# EasyEDA Pro project Power_Test.eprj

# Schematic Schematic1
Board Name: Board1; Create Date: 2025-09-05; Page Name: P1; Project Name: Power_Test; Schematic Name: Schematic1; Update Date: 2025-09-10; Company: EasyEDA.com; Page Size: A4; Version: V1.0
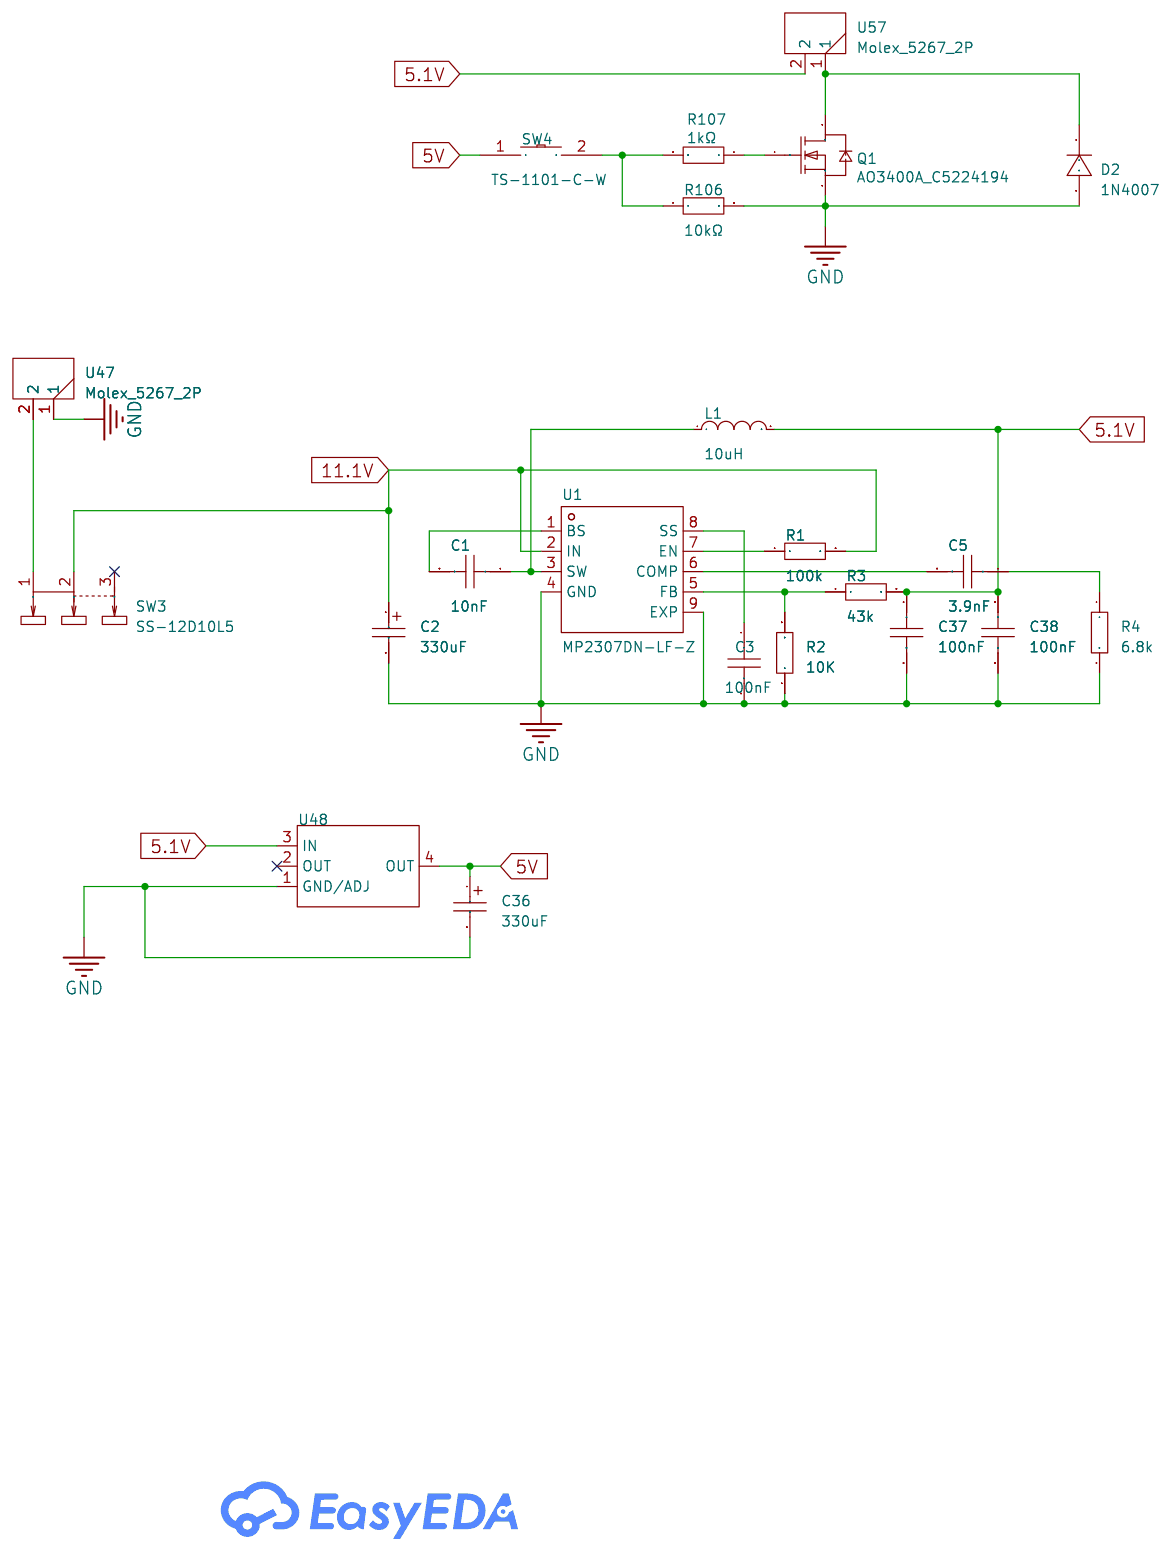
[diagram p0: schematic sheet]

## Parts
C1  10nF  [C0603]
C2  330uF  [CASE-D_7343]
C3  100nF  [C0603]
C5  3.9nF  [C0603]
C36  330uF  [CASE-D_7343]
C37  100nF  [C0603]
C38  100nF  [C0603]
D2  1N4007  [SMA_L4.4-W2.8-LS5.4-RD]
L1  10uH  [IND-SMD_L7.3-W6.6]
Q1  AO3400A_C5224194  [SOT-23-3_L3.0-W1.6-P1.90-LS2.8-BR]
R1  100k  [R0603]
R2  10K  [R0603]
R3  43k  [R0603]
R4  6.8k  [R0603]
R106  10kΩ  [R0603]
R107  1kΩ  [R0603]
SW3  SS-12D10L5  [SW-TH_SS-12D10L5]
SW4  TS-1101-C-W  [SW-SMD_L6.0-W3.3-LS8.0]
U1  MP2307DN-LF-Z  [SOP-8_L4.9-W3.9-P1.27-LS6.0-BL-EP]
U47  Molex_5267_2P  [5267_2P]
U48  AMS1117-5.0  [SOT-223-4_L6.5-W3.5-P2.30-LS7.0-BR]
U57  Molex_5267_2P  [5267_2P]

## Library data of the parts
C1 C3 C5 C37 C38 = CAP_0603: Supplier Footprint: 0603
C2 C36 = TAJD337K010RNJ: Capacitance: Tolerance:±10% Tolerance:±10% Rated Voltage: Equivalent Series Resistance(ESR):900mΩ@100kHz Operating Temperature:-55℃~+125℃ Operating Temperature:-55℃~+125℃; LCSC Part Name: 330uF ±10% 10V; Supplier Part: C7226; Manufacturer: Kyocera AVX; Supplier Footprint: CASE-D-7343; JLCPCB Part Class: Extended Part; Datasheet: https://atta.szlcsc.com/upload/public/pdf/source/20160107/1457707750344.pdf; Supplier: LCSC; Tolerance: ±10%; Equivalent Series Resistance(ESR): 900mΩ@100kHz; Operating Temperature: -55℃~+125℃
D2 = 1N4007_C126233: Diode Configuration:Independent Type Forward Voltage (Vf@If):1.1V@1A Reverse Voltage (Vr): Rectified Current: Reverse Leakage Current (Ir):5uA@1kV; LCSC Part Name: 停产; Supplier Part: C126233; Manufacturer: SHIKUES(时科); Supplier Footprint: SMA(DO-214AC); JLCPCB Part Class: Extended Part; Datasheet: https://atta.szlcsc.com/upload/public/pdf/source/20170818/C126233_1503051236073895256.pdf; Supplier: LCSC; Diode Configuration: Independent Type; Forward Voltage (Vf@If): 1.1V@1A; Reverse Leakage Current (Ir): 5uA@1kV
L1 = BMRB00060630100MA1: LCSC Part Name: 10uH ±20% 5.5A; Supplier Part: C5201679; Manufacturer: Chilisin(奇力新); Supplier Footprint: SMD,6.6x7.3mm; JLCPCB Part Class: Extended Part; Datasheet: https://item.szlcsc.com/datasheet/BMRB00060630100MA1/5890754.html; Supplier: LCSC; Tolerance: ±20%; Current Rating: 4A; Current - Saturation(Isat): 5.5A; DC Resistance(DCR): 68mΩ; Type: Magnetic Shielded Inductor
Q1 = AO3400A_C5224194: Supplier: LCSC; Supplier Part: C5224194; Manufacturer: ElecSuper(静芯微); Manufacturer Part: AO3400A; JLCPCB Part Class: Extended Part
R1-R4 = Res_0603: Supplier Footprint: 0603
R106 R107 = 1kΩ: Supplier: LCSC; Manufacturer: UNI-ROYAL(厚声); Manufacturer Part: 0603WAF1001T5E; Supplier Part: C21190; JLCPCB Part Class: Basic Part; link: https://lcsc.com/eda_search?q=C21190&%26type=1&ref=editor
SW3 = SS-12D10L5: Circuit:SPDT Actuator Style:Rectangular columnar Pin Style:PCPin Switch Length:13mm Switch Width:6.8mm Switch Height:6.4mm Mounting Style:Straight Actuator Color:Black Current Rating (DC):3A Voltage Rating (DC):125V Current Rating (AC):3A Voltage Rating (; LCSC Part Name: 柄长5mm 直插双档 滑动开关; Supplier Part: C319012; Manufacturer: XKB Connectivity(中国星坤); Supplier Footprint: 插件; JLCPCB Part Class: Extended Part; Datasheet: https://atta.szlcsc.com/upload/public/pdf/source/20211009/D6412F37AABE6F9459A6EE7FA4DAEADB.pdf; Supplier: LCSC; Circuit: SPDT; Actuator Style: Rectangular columnar; Pin Style: PCPin; Switch Length: 13mm; Switch Width: 6.8mm; Switch Height: 6.4mm; Mounting Style: Straight; Actuator Color: Black; Current Rating (DC): 3A; Voltage Rating (DC): 125V; Current Rating (AC): 3A; Voltage Rating (AC): 125V; Mechanical Life: 1万次; Operating Temperature: -40℃~+85℃
SW4 = TS-1101-C-W: LCSC Part Name: 6*3.6*2.5mm 立贴 轻触开关; Supplier Part: C318938; Manufacturer: XKB Connectivity(中国星坤); Supplier Footprint: SMD; JLCPCB Part Class: Extended Part; Datasheet: https://atta.szlcsc.com/upload/public/pdf/source/20200227/C318938_C2E53B1EEDE37D980A33616AC086DE53.pdf; Supplier: LCSC; Circuit: SPST; Actuator Style: Rectangle button; Operating Force: 260gf; Mounting Style: Brick nogging; Switch Length: 6mm; Switch Width: 3.6mm; Switch Height: 2.5mm; Strike Gundam: 不带; Contact Current: 50mA; Voltage Rating (DC): 12V; Actuator/Cap Color: 白色带淡绿; With Lamp: No; Mechanical Life: 5万次; Operating Temperature: -30℃~+85℃
U1 = MP2307DN-LF-Z: LCSC Part Name: 3A，23V，340KHz同步整流降压转换器; Supplier Part: C18921; Manufacturer: MPS(芯源); Supplier Footprint: SOIC-8N-EP-150mil; JLCPCB Part Class: Extended Part; Datasheet: https://item.szlcsc.com/datasheet/MP2307DN-LF-Z/19624.html; Supplier: LCSC; Function: Buck; Output Type: Adjustable; Voltage - Supply: 4.75V~23V; Output Voltage: 925mV~20V; Output Current: 3A; Operating Temperature: -40℃~+85℃; Synchronous Rectifier: Yes; Number of Outputs: 1; Topology: Buck; Switch tube (built-in/external): Built-in
U47 U57 = Molex_5267_2P
U48 = AMS1117-5.0_C489390: Output Type:Fixed Voltage - Supply:18V Output Voltage:5V Output Voltage:5V Output Current:800mA Power Supply Rejection Ratio (PSRR):- Voltage Dropout:1.3V@(800mA) Features:热关断(TSD) Output Configuration:Positive electrode Number of Outputs:1; LCSC Part Name: 输入18V 输出5V 800mA; Supplier Part: C489390; Manufacturer: KEXIN(科信); Supplier Footprint: SOT-223-4; JLCPCB Part Class: Extended Part; Datasheet: https://atta.szlcsc.com/upload/public/pdf/source/20200225/C489390_741098F4D0B289080ED6EC6326BDA35D.pdf; Supplier: LCSC; Output Type: Fixed; Voltage - Supply: 18V; Output Voltage: 5V; Output Current: 800mA; Voltage Dropout: 1.3V@(800mA); Features: 热关断(TSD); Output Configuration: Positive electrode; Number of Outputs: 1

## Nets
5.1V: C37.1 C38.1 L1.2 R3.2 U48.3(IN) U57.2
5V: C36.1 SW4.1 U48.4(OUT)
11.1V: C2.1 R1.2 SW3.2 U1.2(IN)
GND: C2.2 C3.2 C36.2 C37.2 C38.2 D2.2 Q1.2(S) R2.1 R4.2 R106.2 U1.4(GND) U1.9(EXP) U47.1 U48.1(GND/ADJ)
$1N529: C1.1 L1.1 U1.3(SW)
$1N557: C1.2 U1.1(BS)
$1N939: R1.1 U1.7(EN)
$1N946: R2.2 R3.1 U1.5(FB)
$1N1067: C3.1 U1.8(SS)
$1N1166: C5.2 U1.6(COMP)
$1N1221: C5.1 R4.1
$1N1682: SW3.1 U47.2
$1N1959: Q1.1(G) R107.1
$1N1960: R106.1 R107.2 SW4.2
$1N1961: D2.1 Q1.3(D) U57.1

Not connected (* = marked no-connect by the designer): SW3 3*; U48 2(OUT)*

# Board PCB1
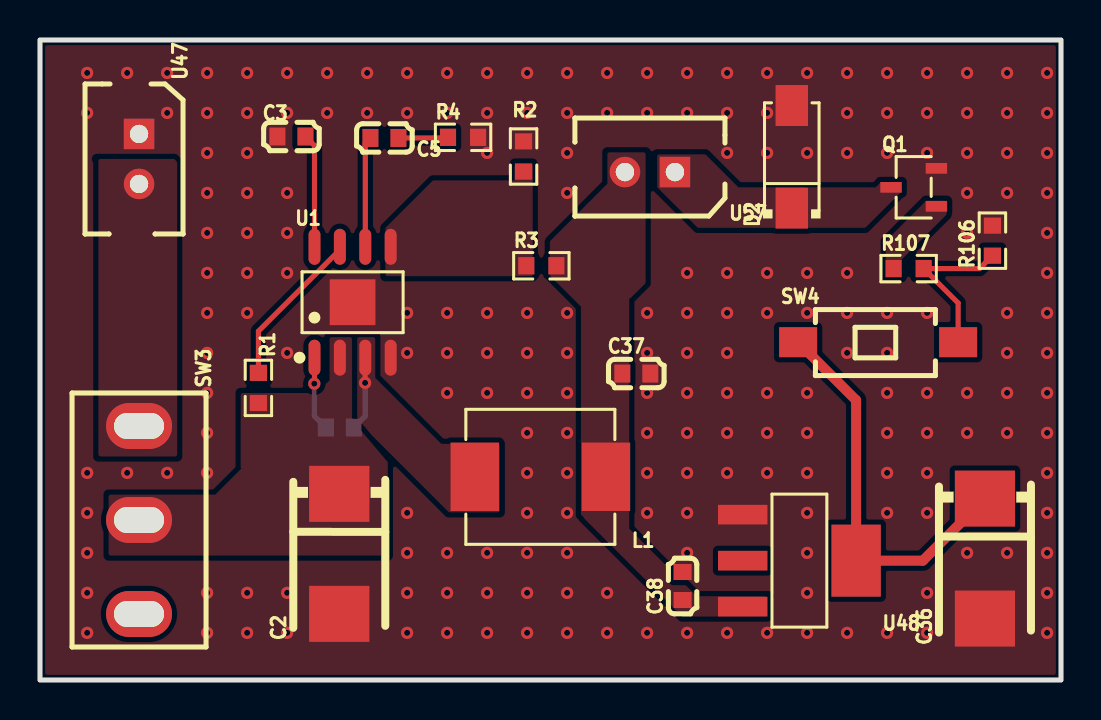
[diagram p1: board, top side]
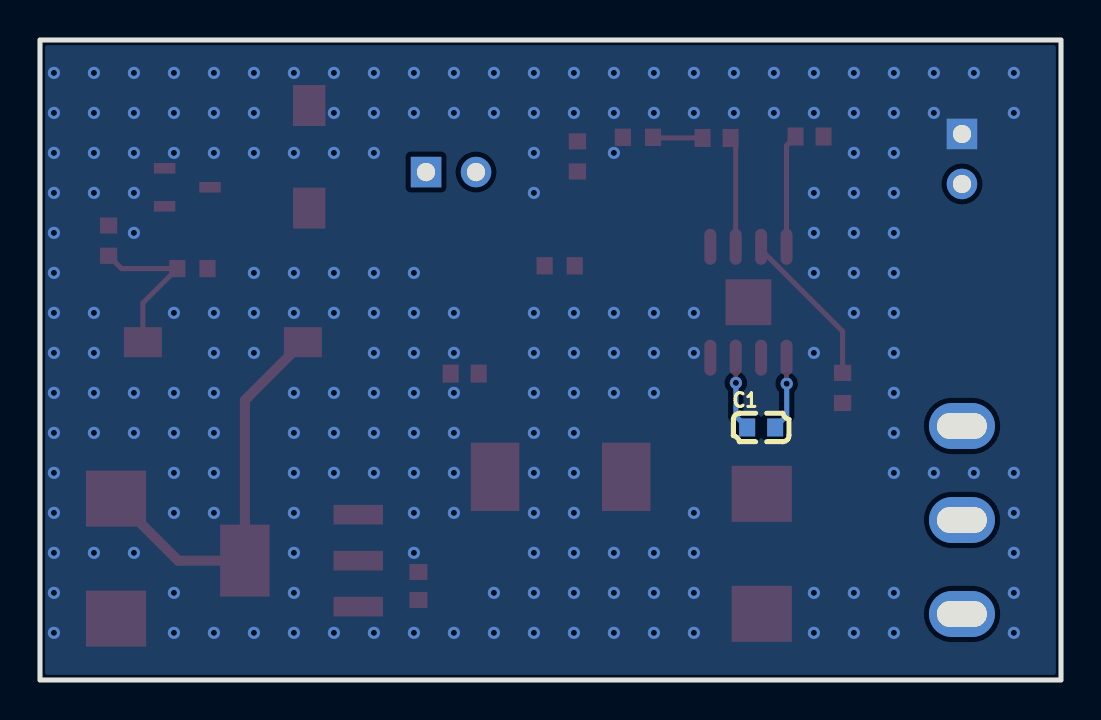
[diagram p2: board, bottom side, seen from below]

Outline 51.05 x 32 mm; copper layers: Top Layer, Bottom Layer. Coordinates in mm from the lower left corner of the outline.
Outline path: rectangle 0,32 51.05,0
Stack: Top Layer 0.035mm / Dielectric1 1.51mm FR4 er 4.5 / Bottom Layer 0.035mm

## Design rules (mm)
template: Custom Config
spacing copperThickness1oz (default): track to track 0.102, other pairs 0.152 to 0.3
spacing copperThickness2oz: track to track 0.203, other pairs 0.152 to 0.3
track width copperThickness1oz (default): min 0.127, default 0.254, max 2.54
track width copperThickness2oz: min 0.203, default 0.254, max 2.54
track width 5V: min 0.2, default 0.5, max 1
differential pair differentialPair (default): width min 0.127, default 0.254, max 2.54; gap min 0.152, default 0.152
via viaSize (default): diameter min 0.5, default 0.61, max 10; hole min 0.3, default 0.305, max 6.3
net 5V uses 5V
net 5.1V uses 5V

## Placement (name value [footprint] x y rotation side)
C1  10nF  [C0603]  14.99 12.63 180 bottom
C2  330uF  [CASE-D_7343]  14.97 6.31 90 top
C3  100nF  [C0603]  12.57 27.18 180 top
C5  3.9nF  [C0603]  17.22 27.11 180 top
C36  330uF  [CASE-D_7343]  47.25 6.07 90 top
C37  100nF  [C0603]  29.82 15.33 0 top
C38  100nF  [C0603]  32.13 4.7 90 top
D2  1N4007  [SMA_L4.4-W2.8-LS5.4-RD]  37.59 26.16 90 top
L1  10uH  [IND-SMD_L7.3-W6.6]  25.02 10.16 180 top
Q1  AO3400A_C5224194  [SOT-23-3_L3.0-W1.6-P1.90-LS2.8-BR]  43.69 24.64 0 top
R1  100k  [R0603]  10.92 14.61 270 top
R2  10K  [R0603]  24.18 26.18 270 top
R3  43k  [R0603]  25.07 20.71 0 top
R4  6.8k  [R0603]  21.15 27.14 0 top
R106  10kΩ  [R0603]  47.62 21.97 90 top
R107  1kΩ  [R0603]  43.43 20.57 0 top
SW3  SS-12D10L5  [SW-TH_SS-12D10L5]  4.95 8 270 top
SW4  TS-1101-C-W  [SW-SMD_L6.0-W3.3-LS8.0]  41.91 16.89 0 top
U1  MP2307DN-LF-Z  [SOP-8_L4.9-W3.9-P1.27-LS6.0-BL-EP]  15.63 18.89 0 top
U47  Molex_5267_2P  [5267_2P]  4.95 27.31 270 top
U48  AMS1117-5.0  [SOT-223-4_L6.5-W3.5-P2.30-LS7.0-BR]  37.97 5.97 180 top
U57  Molex_5267_2P  [5267_2P]  31.75 25.4 180 top

## Footprints (pads in the part's own frame, mm; a bottom-side part is the same pattern mirrored in y, then rotated)
5267_2P
  rect 1.524x1.524 hole 0.914: 1(0,0)
  round 1.524 hole 0.914: 2(2.5,0)
C0603
  rect 0.8x0.9 smd: 1(-0.7,0) 2(0.7,0)
CASE-D_7343
  rect 2.799x3.01 smd: 1(3,0) 2(-3,0)
IND-SMD_L7.3-W6.6
  rect 2.424x3.42 smd: 1(3.278,0) 2(-3.278,0)
R0603
  rect 0.806x0.864 smd: 1(-0.753,0) 2(0.753,0)
SMA_L4.4-W2.8-LS5.4-RD
  rect 2.046x1.62 smd: 1(-2.566,0) 2(2.566,0)
SOP-8_L4.9-W3.9-P1.27-LS6.0-BL-EP
  oval 0.6x1.8 smd: 1(-1.905,-2.772) 2(-0.635,-2.772) 3(0.635,-2.772) 4(1.905,-2.772) 5(1.905,2.772) 6(0.635,2.772) 7(-0.635,2.772) 8(-1.905,2.772)
  rect 2.29x2.29 smd: 9(0,0)
SOT-23-3_L3.0-W1.6-P1.90-LS2.8-BR
  rect 1.07x0.532 smd: 1(1.135,-0.95) 2(1.135,0.95) 3(-1.135,0)
SOT-223-4_L6.5-W3.5-P2.30-LS7.0-BR
  rect 2.47x0.98 smd: 1(2.835,-2.3) 2(2.835,0) 3(2.835,2.3)
  rect 2.47x3.6 smd: 4(-2.835,0)
SW-SMD_L6.0-W3.3-LS8.0
  rect 1.9x1.5 smd: 1(-4,0) 2(4,0)
SW-TH_SS-12D10L5
  oval 2.3x3.3 hole 1.3x2.5: 1(-4.7,0) 2(0,0) 3(4.7,0)

## Nets
As in the schematic.

Pads without a net: SW3 3; U48 2

## Via types
v1: diameter 0.61, hole 0.305, Top Layer to Bottom Layer, 210 vias

## Routing (per net, layer and track width the routed paths; a pad name or vN(x,y) marks a point on that pad's centre or on a via; arc(x,y) is an arc through that point)
5V: length 19.9
  Top Layer w0.5: C36.1 44.15,5.97 U48.4 40.81,13.99 SW4.1
GND:
  vias: v1(2.36,30.36) v1(2.36,28.36) v1(2.36,10.36) v1(2.36,8.36) v1(2.36,6.36) v1(2.36,4.36) v1(2.36,2.36) v1(4.36,30.36) v1(4.36,10.36) v1(6.36,30.36) v1(6.36,28.36) v1(6.36,10.36) v1(8.36,30.36) v1(8.36,28.36) v1(8.36,26.36) v1(8.36,24.36) v1(8.36,22.36) v1(8.36,20.36) v1(8.36,18.36) v1(8.36,16.36) v1(8.36,14.36) v1(8.36,12.36) v1(8.36,10.36) v1(8.36,4.36) v1(8.36,2.36) v1(10.36,30.36) v1(10.36,28.36) v1(10.36,26.36) v1(10.36,24.36) v1(10.36,22.36) v1(10.36,20.36) v1(10.36,18.36) v1(10.36,4.36) v1(10.36,2.36) v1(12.36,30.36) v1(12.36,28.36) v1(12.36,24.36) v1(12.36,22.36) v1(12.36,20.36) v1(12.36,16.36) v1(12.36,4.36) v1(12.36,2.36) v1(14.36,30.36) v1(14.36,28.36) v1(16.36,30.36) v1(16.36,28.36) v1(18.36,30.36) v1(18.36,28.36) v1(18.36,18.36) v1(18.36,16.36) v1(18.36,8.36) v1(18.36,6.36) v1(18.36,4.36) v1(18.36,2.36) v1(20.36,30.36) v1(20.36,28.36) v1(20.36,18.36) v1(20.36,16.36) v1(20.36,14.36) v1(20.36,6.36) v1(20.36,4.36) v1(20.36,2.36) v1(22.36,30.36) v1(22.36,28.36) v1(22.36,26.36) v1(22.36,18.36) v1(22.36,16.36) v1(22.36,14.36) v1(22.36,6.36) v1(22.36,4.36) v1(22.36,2.36) v1(24.36,30.36) v1(24.36,28.36) v1(24.36,18.36) v1(24.36,16.36) v1(24.36,14.36) v1(24.36,12.36) v1(24.36,10.36) v1(24.36,8.36) v1(24.36,6.36) v1(24.36,4.36) v1(24.36,2.36) v1(26.36,30.36) v1(26.36,28.36) v1(26.36,26.36) v1(26.36,24.36) v1(26.36,18.36) v1(26.36,16.36) v1(26.36,14.36) v1(26.36,12.36) v1(26.36,10.36) v1(26.36,8.36) v1(26.36,6.36) v1(26.36,4.36) v1(26.36,2.36) v1(28.36,30.36) v1(28.36,28.36) v1(28.36,4.36) v1(28.36,2.36) v1(30.36,30.36) v1(30.36,28.36) v1(30.36,18.36) v1(30.36,16.36) v1(30.36,14.36) v1(30.36,12.36) v1(30.36,10.36) v1(30.36,8.36) v1(30.36,2.36) v1(32.36,30.36) v1(32.36,28.36) v1(32.36,20.36) v1(32.36,18.36) v1(32.36,16.36) v1(32.36,14.36) v1(32.36,12.36) v1(32.36,10.36) v1(32.36,8.36) v1(32.36,6.36) v1(32.36,2.36) v1(34.36,30.36) v1(34.36,28.36) v1(34.36,26.36) v1(34.36,20.36) v1(34.36,18.36) v1(34.36,16.36) v1(34.36,14.36) v1(34.36,12.36) v1(34.36,10.36) v1(34.36,2.36) v1(36.36,30.36) v1(36.36,28.36) v1(36.36,26.36) v1(36.36,20.36) v1(36.36,18.36) v1(36.36,14.36) v1(36.36,12.36) v1(36.36,10.36) v1(36.36,2.36) v1(38.36,30.36) v1(38.36,26.36) v1(38.36,20.36) v1(38.36,18.36) v1(38.36,14.36) v1(38.36,12.36) v1(38.36,10.36) v1(38.36,8.36) v1(38.36,6.36) v1(38.36,4.36) v1(38.36,2.36) v1(40.36,30.36) v1(40.36,28.36) v1(40.36,26.36) v1(40.36,20.36) v1(40.36,18.36) v1(40.36,16.36) v1(40.36,2.36) v1(42.36,30.36) v1(42.36,28.36) v1(42.36,26.36) v1(42.36,18.36) v1(42.36,16.36) v1(42.36,14.36) v1(42.36,12.36) v1(42.36,10.36) v1(42.36,8.36) v1(42.36,2.36) v1(44.36,30.36) v1(44.36,28.36) v1(44.36,26.36) v1(44.36,18.36) v1(44.36,14.36) v1(44.36,12.36) v1(44.36,10.36) v1(44.36,8.36) v1(44.36,4.36) v1(44.36,2.36) v1(46.36,30.36) v1(46.36,28.36) v1(46.36,26.36) v1(46.36,24.36) v1(46.36,22.36) v1(46.36,14.36) v1(46.36,12.36) v1(46.36,6.36) v1(48.36,30.36) v1(48.36,28.36) v1(48.36,26.36) v1(48.36,24.36) v1(48.36,18.36) v1(48.36,16.36) v1(48.36,14.36) v1(48.36,12.36) v1(48.36,6.36) v1(50.36,30.36) v1(50.36,28.36) v1(50.36,26.36) v1(50.36,24.36) v1(50.36,22.36) v1(50.36,20.36) v1(50.36,18.36) v1(50.36,16.36) v1(50.36,14.36) v1(50.36,12.36) v1(50.36,10.36) v1(50.36,8.36) v1(50.36,6.36) v1(50.36,4.36) v1(50.36,2.36)
$1N529: length 3.7
  Top Layer w0.254: U1.3 16.26,16.11 v1(16.26,14.86)
  Bottom Layer w0.254: C1.1 16.26,13.19 v1(16.26,14.86)
$1N557: length 3.7
  Top Layer w0.254: U1.1 13.73,14.83 v1(13.72,14.82)
  Bottom Layer w0.254: C1.2 13.72,13.21 v1(13.72,14.82)
$1N939: length 8
  Top Layer w0.254: R1.1 10.92,17.44 15,21.51 U1.7
$1N1067: length 5.7
  Top Layer w0.254: C3.1 13.73,26.73 U1.8
$1N1166: length 5.5
  Top Layer w0.254: C5.2 16.27,26.85 U1.6
$1N1221: length 2.5
  Top Layer w0.254: C5.1 20.37,27.11 R4.1
$1N1960: length 8.1
  Top Layer w0.254: SW4.2 45.91,18.85 R107.2 46.98,20.57 R106.1

## Copper pours and planes (outline as drawn; the poured copper is in the pictures)
5.1V on Top Layer: 30.28,26.39 28.37,26.39 28.37,24.82 25.5,21.94 25.5,20.37 28.14,20.37 29.47,19.04 30.28,19.84
5.1V on Top Layer: 27.18,11.81 27.18,8.11 32.11,3.18 36.32,3.18 36.32,4.06 36.45,4.19 32.84,4.19 29.46,7.57 29.46,9.53
5.1V on Top Layer: 25.5,21.12 25.5,20.22 27.05,18.67 27.05,8.26 27.22,8.13 29.21,8.13 29.46,8.38 29.46,19.18 27.52,21.12
11.1V on Top Layer: 13.84,14.35 10.03,14.35 10.03,10.54 13.59,10.54 13.84,10.8
11.1V on Top Layer: 15.6,17.09 15.55,17.15 14.48,17.15 14.48,14.99 8.76,9.27 3.43,9.27 3.43,6.22 17.39,6.22 17.39,10.89 15.6,13.01
GND on Top Layer: -0.91,32.79 51.45,32.79 51.85,33.19 51.85,-0.54 52.05,-0.74 -0.78,-0.74 -1.25,-0.27 -1.25,32.45
GND on Bottom Layer: -0.71,32.66 51.28,32.66 51.58,32.36 51.58,-0.71 51.64,-0.77 -0.17,-0.77 -0.71,-0.23
$1N529 on Top Layer: 15.75,17.15 16.76,17.15 16.76,15.11 20.07,11.81 22.99,11.81 22.99,8.38 20.45,8.38 15.75,13.08
$1N946 on Top Layer: 23.73,25.78 23.73,24.98 19.65,24.98 17.27,22.61 17.27,20.19 24.64,20.19 24.64,25.78
$1N1682 on Top Layer: 2.85,26.05 6.71,26.05 6.86,25.91 6.86,11.18 2.92,11.18 2.92,11.3 2.92,25.98
$1N1959 on Top Layer: 45.34,23.97 44.31,23.97 42.29,21.95 42.29,20.94 42.99,20.94 45.33,23.28 45.33,23.45 45.34,23.46
$1N1961 on Top Layer: 30.86,26.29 33.27,26.29 34.92,24.64 38.35,24.64 38.35,22.61 32.89,22.61 30.86,24.64
$1N1961 on Top Layer: 38.35,24.64 41.78,24.64 42.04,24.89 43.05,24.89 43.05,24.4 41.26,22.61 36.83,22.61 38.35,24.13
